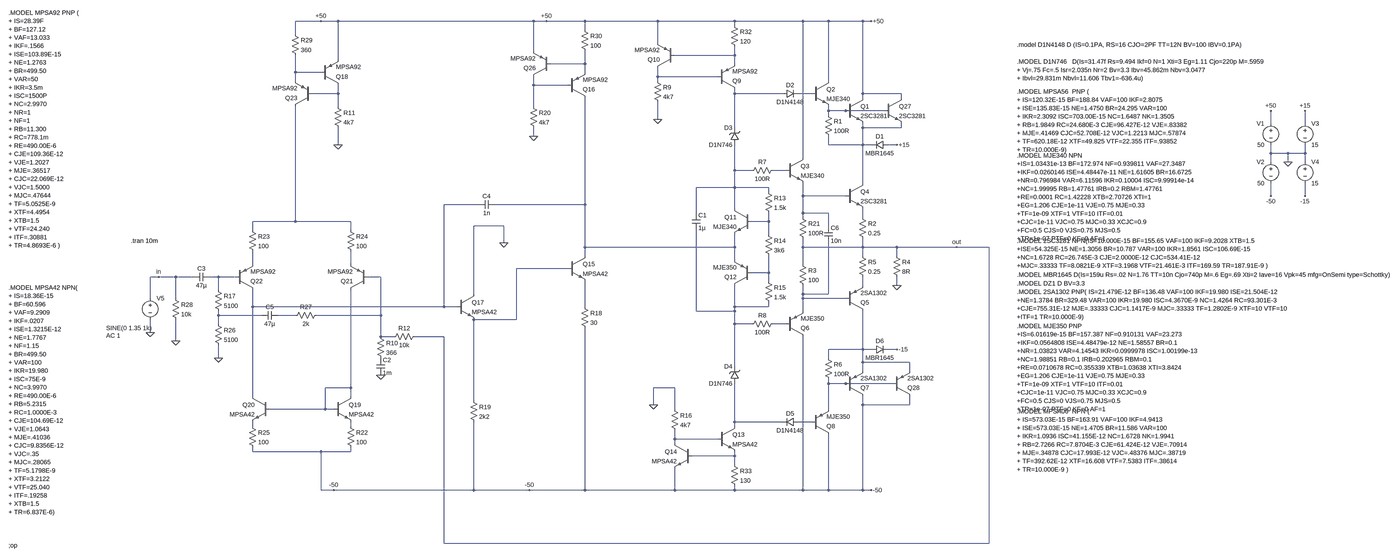
[diagram p0: schematic Clase G20062015_fft.asc, whole sheet]
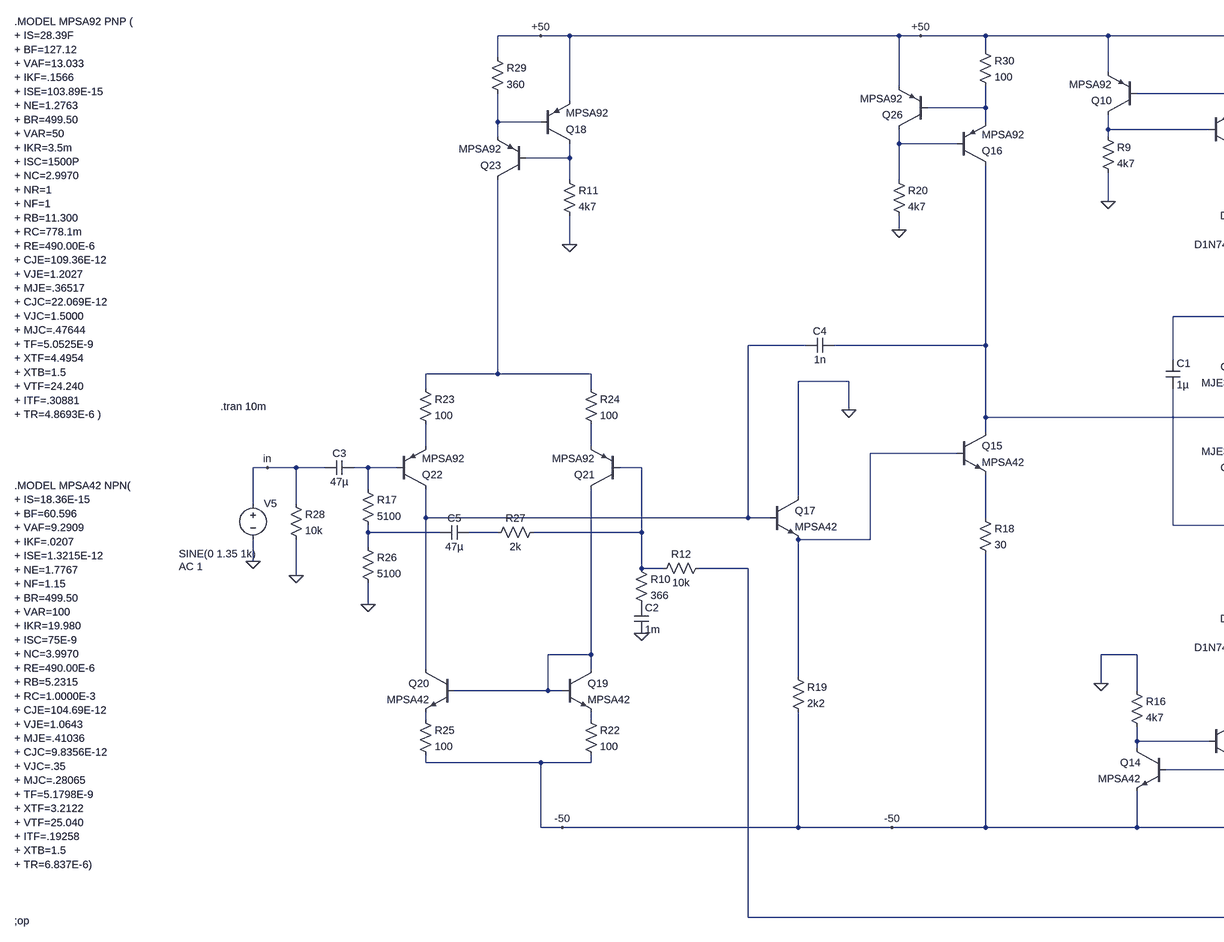
[diagram p1: schematic Clase G20062015_fft.asc, part, row 1 of 1, column 1 of 2]
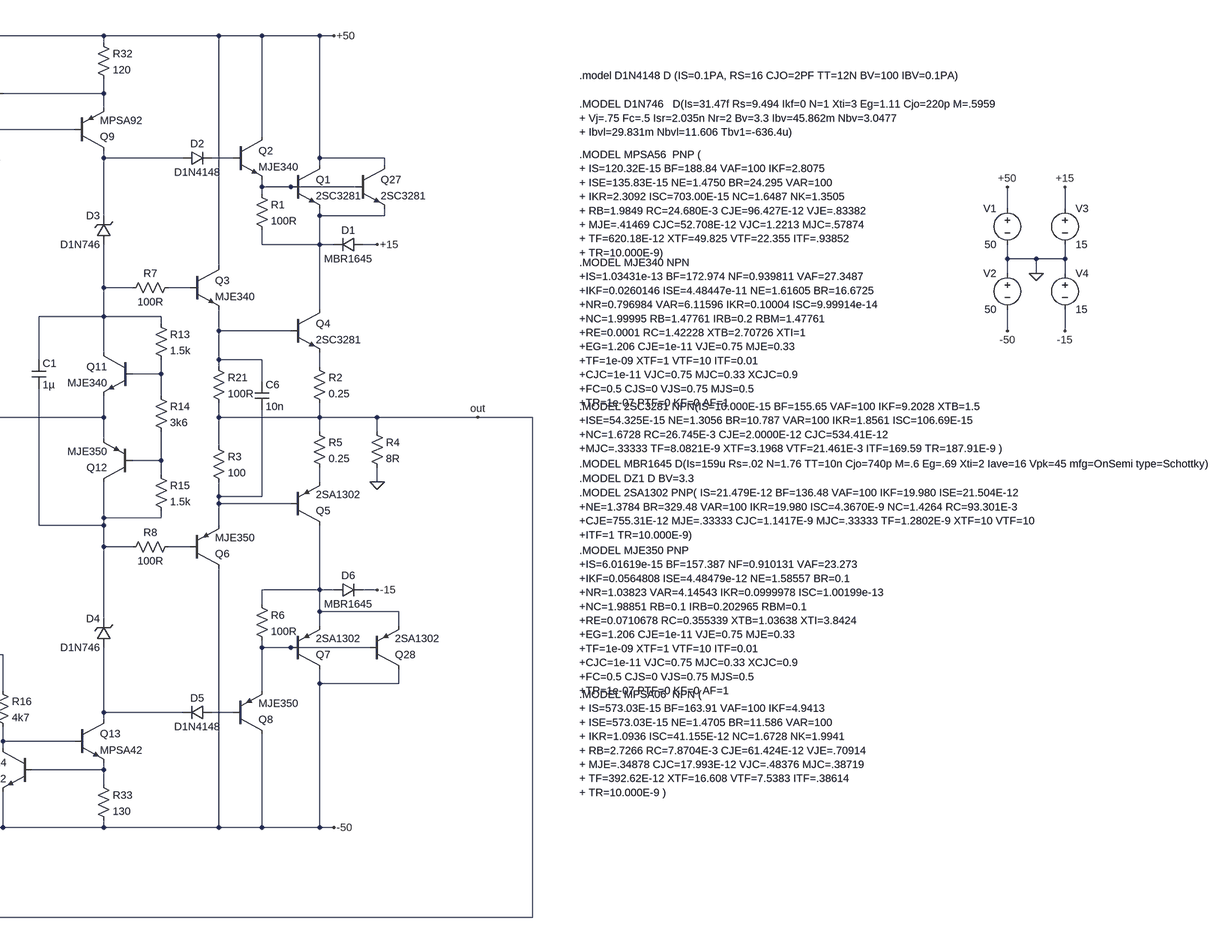
[diagram p2: schematic Clase G20062015_fft.asc, part, row 1 of 1, column 2 of 2]
Clase G20062015_fft.asc, the LTspice schematic file:
Version 4
SHEET 1 4608 680
WIRE 80 -1584 -16 -1584
WIRE 144 -1584 80 -1584
WIRE 992 -1584 144 -1584
WIRE 1040 -1584 992 -1584
WIRE 1184 -1584 1040 -1584
WIRE 1472 -1584 1184 -1584
WIRE 1760 -1584 1472 -1584
WIRE 2016 -1584 1760 -1584
WIRE 2112 -1584 2016 -1584
WIRE 2240 -1584 2112 -1584
WIRE 2272 -1584 2240 -1584
WIRE 1760 -1568 1760 -1584
WIRE 1184 -1552 1184 -1584
WIRE -16 -1536 -16 -1584
WIRE 1472 -1504 1472 -1584
WIRE 992 -1472 992 -1584
WIRE 1760 -1456 1760 -1488
WIRE 1760 -1456 1536 -1456
WIRE 144 -1440 144 -1584
WIRE 1184 -1424 1184 -1472
WIRE 1184 -1424 1056 -1424
WIRE 1760 -1424 1760 -1456
WIRE -16 -1392 -16 -1456
WIRE 80 -1392 -16 -1392
WIRE 1184 -1392 1184 -1424
WIRE 1472 -1376 1472 -1408
WIRE 1696 -1376 1472 -1376
WIRE -16 -1360 -16 -1392
WIRE 1472 -1360 1472 -1376
WIRE 2112 -1360 2112 -1584
WIRE 992 -1344 992 -1376
WIRE 1120 -1344 992 -1344
WIRE 144 -1312 144 -1344
WIRE 144 -1312 48 -1312
WIRE 1760 -1312 1760 -1328
WIRE 1936 -1312 1760 -1312
WIRE 2048 -1312 2000 -1312
WIRE 2240 -1312 2240 -1584
WIRE 2384 -1312 2240 -1312
WIRE 2240 -1296 2240 -1312
WIRE 2384 -1296 2384 -1312
WIRE 144 -1264 144 -1312
WIRE 992 -1264 992 -1344
WIRE 2112 -1248 2112 -1264
WIRE 2176 -1248 2112 -1248
WIRE 2320 -1248 2176 -1248
WIRE 2112 -1232 2112 -1248
WIRE 1472 -1216 1472 -1280
WIRE 3936 -1200 3936 -1248
WIRE 4064 -1200 4064 -1248
WIRE 1760 -1184 1760 -1312
WIRE 2240 -1184 2240 -1200
WIRE 2384 -1184 2384 -1200
WIRE 2384 -1184 2240 -1184
WIRE 992 -1152 992 -1184
WIRE 144 -1120 144 -1184
WIRE 2112 -1120 2112 -1152
WIRE 2240 -1120 2240 -1184
WIRE 2240 -1120 2112 -1120
WIRE 2272 -1120 2240 -1120
WIRE 2368 -1120 2336 -1120
WIRE 3936 -1088 3936 -1120
WIRE 4000 -1088 3936 -1088
WIRE 4064 -1088 4064 -1120
WIRE 4064 -1088 4000 -1088
WIRE 2016 -1072 2016 -1584
WIRE 3936 -1056 3936 -1088
WIRE 4000 -1056 4000 -1088
WIRE 4064 -1056 4064 -1088
WIRE 1760 -1024 1760 -1120
WIRE 1824 -1024 1760 -1024
WIRE 1952 -1024 1904 -1024
WIRE 2240 -976 2240 -1120
WIRE 1760 -960 1760 -1024
WIRE 1760 -960 1616 -960
WIRE 1888 -960 1760 -960
WIRE 1888 -944 1888 -960
WIRE 2016 -928 2016 -976
WIRE 2176 -928 2016 -928
WIRE 3936 -928 3936 -976
WIRE 4064 -928 4064 -976
WIRE 784 -896 656 -896
WIRE 1184 -896 1184 -1296
WIRE 1184 -896 848 -896
WIRE 1760 -880 1760 -960
WIRE 1616 -864 1616 -960
WIRE 2016 -864 2016 -928
WIRE 2112 -864 2016 -864
WIRE 2016 -848 2016 -864
WIRE 2240 -848 2240 -880
WIRE -16 -832 -16 -1264
WIRE -16 -832 -176 -832
WIRE 192 -832 -16 -832
WIRE 1888 -832 1888 -864
WIRE 1888 -832 1824 -832
WIRE 880 -816 768 -816
WIRE 2112 -816 2112 -864
WIRE -176 -800 -176 -832
WIRE 192 -800 192 -832
WIRE 1888 -784 1888 -832
WIRE 880 -752 880 -816
WIRE 1184 -736 1184 -896
WIRE 1760 -736 1760 -784
WIRE 1760 -736 1184 -736
WIRE 2016 -736 2016 -768
WIRE 2240 -736 2240 -768
WIRE 2240 -736 2016 -736
WIRE 2368 -736 2240 -736
WIRE 2592 -736 2368 -736
WIRE 2752 -736 2592 -736
WIRE 1184 -704 1184 -736
WIRE 2240 -704 2240 -736
WIRE 2368 -704 2368 -736
WIRE 1760 -688 1760 -736
WIRE -176 -672 -176 -720
WIRE 192 -672 192 -720
WIRE 2016 -672 2016 -736
WIRE 1120 -656 928 -656
WIRE 1888 -640 1888 -704
WIRE 1888 -640 1824 -640
WIRE -528 -624 -560 -624
WIRE -464 -624 -528 -624
WIRE -400 -624 -464 -624
WIRE -304 -624 -336 -624
WIRE -240 -624 -304 -624
WIRE 304 -624 256 -624
WIRE 1888 -608 1888 -640
WIRE 2240 -592 2240 -624
WIRE 2368 -592 2368 -624
WIRE -304 -576 -304 -624
WIRE 768 -560 768 -816
WIRE 2016 -560 2016 -592
WIRE 2112 -560 2112 -752
WIRE 2112 -560 2016 -560
WIRE -560 -544 -560 -624
WIRE -464 -544 -464 -624
WIRE 2016 -544 2016 -560
WIRE 2176 -544 2016 -544
WIRE -176 -512 -176 -576
WIRE 656 -512 656 -896
WIRE 656 -512 -176 -512
WIRE 704 -512 656 -512
WIRE 1184 -512 1184 -608
WIRE 1760 -512 1760 -592
WIRE 1888 -512 1888 -528
WIRE 1888 -512 1760 -512
WIRE 1616 -496 1616 -800
WIRE 1760 -496 1760 -512
WIRE 1760 -496 1616 -496
WIRE 2016 -496 2016 -544
WIRE -304 -480 -304 -496
WIRE -144 -480 -304 -480
WIRE -16 -480 -80 -480
WIRE 304 -480 304 -624
WIRE 304 -480 64 -480
WIRE 928 -464 928 -656
WIRE 928 -464 768 -464
WIRE -304 -448 -304 -480
WIRE 1760 -448 1760 -496
WIRE 1824 -448 1760 -448
WIRE 1952 -448 1904 -448
WIRE -560 -416 -560 -464
WIRE 304 -400 304 -480
WIRE 352 -400 304 -400
WIRE 656 -400 432 -400
WIRE -464 -384 -464 -464
WIRE 2240 -352 2240 -496
WIRE 2240 -352 2112 -352
WIRE 2272 -352 2240 -352
WIRE 2368 -352 2336 -352
WIRE 192 -336 192 -576
WIRE -304 -320 -304 -368
WIRE -176 -320 -176 -512
WIRE 2112 -320 2112 -352
WIRE 2240 -304 2240 -352
WIRE 2416 -304 2240 -304
WIRE 1760 -288 1760 -448
WIRE 2240 -272 2240 -304
WIRE 2416 -272 2416 -304
WIRE 2112 -224 2112 -240
WIRE 2176 -224 2112 -224
WIRE 2352 -224 2176 -224
WIRE 192 -208 192 -336
WIRE 192 -208 96 -208
WIRE 1536 -208 1456 -208
WIRE -176 -176 -176 -320
WIRE 192 -176 192 -208
WIRE 768 -160 768 -464
WIRE 1456 -144 1456 -208
WIRE 2240 -144 2240 -176
WIRE 2416 -144 2416 -176
WIRE 2416 -144 2240 -144
WIRE 96 -128 96 -208
WIRE 96 -128 -112 -128
WIRE 128 -128 96 -128
WIRE 1536 -128 1536 -208
WIRE 2112 -128 2112 -224
WIRE 1760 -80 1760 -224
WIRE 1936 -80 1760 -80
WIRE 2048 -80 2000 -80
WIRE -176 -64 -176 -80
WIRE 192 -64 192 -80
WIRE 1760 -64 1760 -80
WIRE 1536 -16 1536 -48
WIRE 1696 -16 1536 -16
WIRE 1536 0 1536 -16
WIRE -176 32 -176 16
WIRE 80 32 -176 32
WIRE 192 32 192 16
WIRE 192 32 80 32
WIRE 1760 48 1760 32
WIRE 1760 48 1600 48
WIRE 1760 80 1760 48
WIRE 80 176 80 32
WIRE 128 176 80 176
WIRE 768 176 768 -80
WIRE 768 176 128 176
WIRE 976 176 768 176
WIRE 1184 176 1184 -432
WIRE 1184 176 976 176
WIRE 1536 176 1536 96
WIRE 1536 176 1184 176
WIRE 1760 176 1760 160
WIRE 1760 176 1536 176
WIRE 2016 176 2016 -400
WIRE 2016 176 1760 176
WIRE 2112 176 2112 -32
WIRE 2112 176 2016 176
WIRE 2240 176 2240 -144
WIRE 2240 176 2112 176
WIRE 2272 176 2240 176
WIRE 656 384 656 -400
WIRE 2752 384 2752 -736
WIRE 2752 384 656 384
FLAG 2368 -592 0
FLAG 2272 176 -50
FLAG 2368 -352 -15
FLAG 2272 -1584 +50
FLAG 2368 -1120 +15
FLAG 1456 -144 0
FLAG 3936 -1248 +50
FLAG 3936 -928 -50
FLAG 4064 -1248 +15
FLAG 4064 -928 -15
FLAG 4000 -1056 0
FLAG 880 -752 0
FLAG -560 -416 0
FLAG 1472 -1216 0
FLAG 144 -1120 0
FLAG -304 -320 0
FLAG 304 -256 0
FLAG 992 -1152 0
FLAG 1040 -1584 +50
FLAG 976 176 -50
FLAG 128 176 -50
FLAG 80 -1584 +50
FLAG -464 -384 0
FLAG -528 -624 in
FLAG 2592 -736 out
DATAFLAG -176 -320 ""
DATAFLAG 192 -336 ""
SYMBOL npn 2176 -1296 R0
SYMATTR InstName Q1
SYMATTR Value 2SC3281
SYMBOL npn 2048 -1360 R0
SYMATTR InstName Q2
SYMATTR Value MJE340
SYMBOL res 2096 -1248 R0
SYMATTR InstName R1
SYMATTR Value 100R
SYMBOL diode 2336 -1136 R90
WINDOW 0 0 32 VBottom 2
WINDOW 3 32 32 VTop 2
SYMATTR InstName D1
SYMATTR Value MBR1645
SYMBOL diode 1936 -1296 R270
WINDOW 0 32 32 VTop 2
WINDOW 3 0 32 VBottom 2
SYMATTR InstName D2
SYMATTR Value D1N4148
SYMBOL zener 1776 -1120 R180
WINDOW 0 24 64 Left 2
WINDOW 3 24 0 Left 2
SYMATTR InstName D3
SYMATTR Value D1N746
SYMBOL npn 1952 -1072 R0
SYMATTR InstName Q3
SYMATTR Value MJE340
SYMBOL npn 2176 -976 R0
SYMATTR InstName Q4
SYMATTR Value 2SC3281
SYMBOL res 2224 -864 R0
SYMATTR InstName R2
SYMATTR Value 0.25
SYMBOL res 2000 -688 R0
SYMATTR InstName R3
SYMATTR Value 100
SYMBOL res 2352 -720 R0
SYMATTR InstName R4
SYMATTR Value 8R
SYMBOL res 2224 -720 R0
SYMATTR InstName R5
SYMATTR Value 0.25
SYMBOL pnp 2176 -496 M180
SYMATTR InstName Q5
SYMATTR Value 2SA1302
SYMBOL pnp 1952 -400 M180
SYMATTR InstName Q6
SYMATTR Value MJE350
SYMBOL pnp 2176 -176 M180
SYMATTR InstName Q7
SYMATTR Value 2SA1302
SYMBOL pnp 2048 -32 M180
SYMATTR InstName Q8
SYMATTR Value MJE350
SYMBOL res 2096 -336 R0
SYMATTR InstName R6
SYMATTR Value 100R
SYMBOL zener 1776 -224 R180
WINDOW 0 24 64 Left 2
WINDOW 3 24 0 Left 2
SYMATTR InstName D4
SYMATTR Value D1N746
SYMBOL diode 2000 -96 R90
WINDOW 0 0 32 VBottom 2
WINDOW 3 32 32 VTop 2
SYMATTR InstName D5
SYMATTR Value D1N4148
SYMBOL diode 2272 -336 R270
WINDOW 0 32 32 VTop 2
WINDOW 3 0 32 VBottom 2
SYMATTR InstName D6
SYMATTR Value MBR1645
SYMBOL res 1920 -1040 R90
WINDOW 0 0 56 VBottom 2
WINDOW 3 32 56 VTop 2
SYMATTR InstName R7
SYMATTR Value 100R
SYMBOL res 1920 -464 R90
WINDOW 0 0 56 VBottom 2
WINDOW 3 32 56 VTop 2
SYMATTR InstName R8
SYMATTR Value 100R
SYMBOL npn 1824 -880 M0
SYMATTR InstName Q11
SYMATTR Value MJE340
SYMBOL pnp 1824 -592 R180
SYMATTR InstName Q12
SYMATTR Value MJE350
SYMBOL res 1872 -960 R0
SYMATTR InstName R13
SYMATTR Value 1.5k
SYMBOL res 1872 -800 R0
SYMATTR InstName R14
SYMATTR Value 3k6
SYMBOL res 1872 -624 R0
SYMATTR InstName R15
SYMATTR Value 1.5k
SYMBOL npn 1696 -64 R0
SYMATTR InstName Q13
SYMATTR Value MPSA42
SYMBOL npn 1600 0 M0
SYMATTR InstName Q14
SYMATTR Value MPSA42
SYMBOL res 1520 -144 R0
SYMATTR InstName R16
SYMATTR Value 4k7
SYMBOL voltage 3936 -1216 M0
SYMATTR InstName V1
SYMATTR Value 50
SYMBOL voltage 3936 -1072 M0
SYMATTR InstName V2
SYMATTR Value 50
SYMBOL voltage 4064 -1216 R0
SYMATTR InstName V3
SYMATTR Value 15
SYMBOL voltage 4064 -1072 R0
SYMATTR InstName V4
SYMATTR Value 15
SYMBOL npn 1120 -704 R0
SYMATTR InstName Q15
SYMATTR Value MPSA42
SYMBOL res 1168 -528 R0
SYMATTR InstName R18
SYMATTR Value 30
SYMBOL npn 704 -560 R0
SYMATTR InstName Q17
SYMATTR Value MPSA42
SYMBOL res 752 -176 R0
SYMATTR InstName R19
SYMATTR Value 2k2
SYMBOL res 2000 -864 R0
SYMATTR InstName R21
SYMATTR Value 100R
SYMBOL npn 128 -176 R0
SYMATTR InstName Q19
SYMATTR Value MPSA42
SYMBOL npn -112 -176 M0
SYMATTR InstName Q20
SYMATTR Value MPSA42
SYMBOL pnp 256 -576 R180
SYMATTR InstName Q21
SYMATTR Value MPSA92
SYMBOL voltage -560 -560 R0
WINDOW 123 -165 156 Left 2
WINDOW 39 0 0 Left 2
WINDOW 3 -165 128 Left 2
SYMATTR Value2 AC 1
SYMATTR Value SINE(0 1.35 1k)
SYMATTR InstName V5
SYMBOL pnp -240 -576 M180
SYMATTR InstName Q22
SYMATTR Value MPSA92
SYMBOL res 176 -80 R0
SYMATTR InstName R22
SYMATTR Value 100
SYMBOL res -192 -816 R0
SYMATTR InstName R23
SYMATTR Value 100
SYMBOL res 176 -816 R0
SYMATTR InstName R24
SYMATTR Value 100
SYMBOL res -192 -80 R0
SYMATTR InstName R25
SYMATTR Value 100
SYMBOL pnp 1696 -1328 M180
SYMATTR InstName Q9
SYMATTR Value MPSA92
SYMBOL pnp 1536 -1408 R180
SYMATTR InstName Q10
SYMATTR Value MPSA92
SYMBOL res 1456 -1376 R0
SYMATTR InstName R9
SYMATTR Value 4k7
SYMBOL pnp 1120 -1296 M180
SYMATTR InstName Q16
SYMATTR Value MPSA92
SYMBOL pnp 80 -1344 M180
SYMATTR InstName Q18
SYMATTR Value MPSA92
SYMBOL res 128 -1280 R0
SYMATTR InstName R11
SYMATTR Value 4k7
SYMBOL pnp 48 -1264 R180
SYMATTR InstName Q23
SYMATTR Value MPSA92
SYMBOL res 288 -416 R0
SYMATTR InstName R10
SYMATTR Value 366
SYMBOL res 448 -416 R90
WINDOW 0 0 56 VBottom 2
WINDOW 3 32 56 VTop 2
SYMATTR InstName R12
SYMATTR Value 10k
SYMBOL res -320 -592 R0
SYMATTR InstName R17
SYMATTR Value 5100
SYMBOL cap 288 -320 R0
SYMATTR InstName C2
SYMATTR Value 1m
SYMBOL cap -336 -640 R90
WINDOW 0 0 32 VBottom 2
WINDOW 3 32 32 VTop 2
SYMATTR InstName C3
SYMATTR Value 47µ
SYMBOL cap 848 -912 R90
WINDOW 0 0 32 VBottom 2
WINDOW 3 32 32 VTop 2
SYMATTR InstName C4
SYMATTR Value 1n
SYMBOL pnp 1056 -1376 R180
SYMATTR InstName Q26
SYMATTR Value MPSA92
SYMBOL res 976 -1280 R0
SYMATTR InstName R20
SYMATTR Value 4k7
SYMBOL cap 1600 -864 R0
SYMATTR InstName C1
SYMATTR Value 1µ
SYMBOL res -320 -464 R0
SYMATTR InstName R26
SYMATTR Value 5100
SYMBOL cap -80 -496 R90
WINDOW 0 0 32 VBottom 2
WINDOW 3 32 32 VTop 2
SYMATTR InstName C5
SYMATTR Value 47µ
SYMBOL res 80 -496 R90
WINDOW 0 0 56 VBottom 2
WINDOW 3 32 56 VTop 2
SYMATTR InstName R27
SYMATTR Value 2k
SYMBOL res -480 -560 R0
SYMATTR InstName R28
SYMATTR Value 10k
SYMBOL cap 2096 -816 R0
SYMATTR InstName C6
SYMATTR Value 10n
SYMBOL npn 2320 -1296 R0
SYMATTR InstName Q27
SYMATTR Value 2SC3281
SYMBOL pnp 2352 -176 M180
SYMATTR InstName Q28
SYMATTR Value 2SA1302
SYMBOL res -32 -1552 R0
SYMATTR InstName R29
SYMATTR Value 360
SYMBOL res 1168 -1568 R0
SYMATTR InstName R30
SYMATTR Value 100
SYMBOL res 1744 -1584 R0
SYMATTR InstName R32
SYMATTR Value 120
SYMBOL res 1744 64 R0
SYMATTR InstName R33
SYMATTR Value 130
TEXT 2984 -600 Left 2 !.MODEL DZ1 D BV=3.3
TEXT 2984 -1320 Left 2 !.MODEL MPSA56  PNP (\n+ IS=120.32E-15 BF=188.84 VAF=100 IKF=2.8075\n+ ISE=135.83E-15 NE=1.4750 BR=24.295 VAR=100\n+ IKR=2.3092 ISC=703.00E-15 NC=1.6487 NK=1.3505\n+ RB=1.9849 RC=24.680E-3 CJE=96.427E-12 VJE=.83382\n+ MJE=.41469 CJC=52.708E-12 VJC=1.2213 MJC=.57874\n+ TF=620.18E-12 XTF=49.825 VTF=22.355 ITF=.93852\n+ TR=10.000E-9)
TEXT 2984 -1080 Left 2 !.MODEL MJE340 NPN\n+IS=1.03431e-13 BF=172.974 NF=0.939811 VAF=27.3487\n+IKF=0.0260146 ISE=4.48447e-11 NE=1.61605 BR=16.6725\n+NR=0.796984 VAR=6.11596 IKR=0.10004 ISC=9.99914e-14\n+NC=1.99995 RB=1.47761 IRB=0.2 RBM=1.47761\n+RE=0.0001 RC=1.42228 XTB=2.70726 XTI=1\n+EG=1.206 CJE=1e-11 VJE=0.75 MJE=0.33\n+TF=1e-09 XTF=1 VTF=10 ITF=0.01\n+CJC=1e-11 VJC=0.75 MJC=0.33 XCJC=0.9\n+FC=0.5 CJS=0 VJS=0.75 MJS=0.5\n+TR=1e-07 PTF=0 KF=0 AF=1
TEXT 2984 -760 Left 2 !.MODEL 2SC3281 NPN(IS=10.000E-15 BF=155.65 VAF=100 IKF=9.2028 XTB=1.5\n+ISE=54.325E-15 NE=1.3056 BR=10.787 VAR=100 IKR=1.8561 ISC=106.69E-15\n+NC=1.6728 RC=26.745E-3 CJE=2.0000E-12 CJC=534.41E-12\n+MJC=.33333 TF=8.0821E-9 XTF=3.1968 VTF=21.461E-3 ITF=169.59 TR=187.91E-9 )
TEXT 2984 -632 Left 2 !.MODEL MBR1645 D(Is=159u Rs=.02 N=1.76 TT=10n Cjo=740p M=.6 Eg=.69 Xti=2 Iave=16 Vpk=45 mfg=OnSemi type=Schottky)
TEXT 2984 -568 Left 2 !.MODEL 2SA1302 PNP( IS=21.479E-12 BF=136.48 VAF=100 IKF=19.980 ISE=21.504E-12\n+NE=1.3784 BR=329.48 VAR=100 IKR=19.980 ISC=4.3670E-9 NC=1.4264 RC=93.301E-3\n+CJE=755.31E-12 MJE=.33333 CJC=1.1417E-9 MJC=.33333 TF=1.2802E-9 XTF=10 VTF=10\n+ITF=1 TR=10.000E-9)
TEXT 2984 -440 Left 2 !.MODEL MJE350 PNP\n+IS=6.01619e-15 BF=157.387 NF=0.910131 VAF=23.273\n+IKF=0.0564808 ISE=4.48479e-12 NE=1.58557 BR=0.1\n+NR=1.03823 VAR=4.14543 IKR=0.0999978 ISC=1.00199e-13\n+NC=1.98851 RB=0.1 IRB=0.202965 RBM=0.1\n+RE=0.0710678 RC=0.355339 XTB=1.03638 XTI=3.8424\n+EG=1.206 CJE=1e-11 VJE=0.75 MJE=0.33\n+TF=1e-09 XTF=1 VTF=10 ITF=0.01\n+CJC=1e-11 VJC=0.75 MJC=0.33 XCJC=0.9\n+FC=0.5 CJS=0 VJS=0.75 MJS=0.5\n+TR=1e-07 PTF=0 KF=0 AF=1
TEXT 2984 -120 Left 2 !.MODEL MPSA06  NPN (\n+ IS=573.03E-15 BF=163.91 VAF=100 IKF=4.9413\n+ ISE=573.03E-15 NE=1.4705 BR=11.586 VAR=100\n+ IKR=1.0936 ISC=41.155E-12 NC=1.6728 NK=1.9941\n+ RB=2.7266 RC=7.8704E-3 CJE=61.424E-12 VJE=.70914\n+ MJE=.34878 CJC=17.993E-12 VJC=.48376 MJC=.38719\n+ TF=392.62E-12 XTF=16.608 VTF=7.5383 ITF=.38614\n+ TR=10.000E-9 )
TEXT 2984 -1432 Left 2 !.MODEL D1N746   D(Is=31.47f Rs=9.494 Ikf=0 N=1 Xti=3 Eg=1.11 Cjo=220p M=.5959\n+ Vj=.75 Fc=.5 Isr=2.035n Nr=2 Bv=3.3 Ibv=45.862m Nbv=3.0477\n+ Ibvl=29.831m Nbvl=11.606 Tbv1=-636.4u)
TEXT 2984 -1496 Left 2 !.model D1N4148 D (IS=0.1PA, RS=16 CJO=2PF TT=12N BV=100 IBV=0.1PA)
TEXT -1424 -1616 Left 2 !.MODEL MPSA92 PNP (\n+ IS=28.39F\n+ BF=127.12\n+ VAF=13.033\n+ IKF=.1566\n+ ISE=103.89E-15\n+ NE=1.2763\n+ BR=499.50\n+ VAR=50\n+ IKR=3.5m\n+ ISC=1500P\n+ NC=2.9970\n+ NR=1\n+ NF=1\n+ RB=11.300\n+ RC=778.1m\n+ RE=490.00E-6\n+ CJE=109.36E-12\n+ VJE=1.2027\n+ MJE=.36517\n+ CJC=22.069E-12\n+ VJC=1.5000\n+ MJC=.47644\n+ TF=5.0525E-9\n+ XTF=4.4954\n+ XTB=1.5\n+ VTF=24.240\n+ ITF=.30881\n+ TR=4.8693E-6 )
TEXT -1424 -584 Left 2 !.MODEL MPSA42 NPN(\n+ IS=18.36E-15\n+ BF=60.596\n+ VAF=9.2909\n+ IKF=.0207\n+ ISE=1.3215E-12\n+ NE=1.7767\n+ NF=1.15\n+ BR=499.50\n+ VAR=100\n+ IKR=19.980\n+ ISC=75E-9\n+ NC=3.9970\n+ RE=490.00E-6\n+ RB=5.2315\n+ RC=1.0000E-3\n+ CJE=104.69E-12\n+ VJE=1.0643\n+ MJE=.41036\n+ CJC=9.8356E-12\n+ VJC=.35\n+ MJC=.28065\n+ TF=5.1798E-9\n+ XTF=3.2122\n+ VTF=25.040\n+ ITF=.19258\n+ XTB=1.5\n+ TR=6.837E-6)
TEXT -1424 392 Left 2 !;op
TEXT -632 -760 Left 2 !.tran 10m

The netlist it stands for:
* Clase G20062015_fft.asc
Q1 +50 N009 N010 0 2SC3281
Q2 +50 N008 N009 0 MJE340
R1 N009 N010 100R
D1 +15 N010 MBR1645
D2 N007 N008 D1N4148
D3 N011 N007 D1N746
Q3 +50 N012 N013 0 MJE340
Q4 N010 N013 N016 0 2SC3281
R2 N016 out 0.25
R3 out N026 100
R4 out 0 8R
R5 out N025 0.25
Q5 N032 N026 N025 0 2SA1302
Q6 -50 N031 N026 0 MJE350
Q7 -50 N034 N032 0 2SA1302
Q8 -50 N036 N034 0 MJE350
R6 N032 N034 100R
D4 N035 N028 D1N746
D5 N036 N035 D1N4148
D6 N032 -15 MBR1645
R7 N012 N011 100R
R8 N031 N028 100R
Q11 N011 N018 N015 0 MJE340
Q12 N028 N022 N015 0 MJE350
R13 N011 N018 1.5k
R14 N018 N022 3k6
R15 N022 N028 1.5k
Q13 N035 N039 N040 0 MPSA42
Q14 N039 N040 -50 0 MPSA42
R16 0 N039 4k7
V1 +50 0 50
V2 0 -50 50
V3 +15 0 15
V4 0 -15 15
Q15 N015 N021 N027 0 MPSA42
R18 N027 -50 30
Q17 0 N014 N021 0 MPSA42
R19 N021 -50 2k2
R21 N013 out 100R
Q19 N033 N033 N038 0 MPSA42
Q20 N014 N033 N037 0 MPSA42
Q21 N033 N024 N020 0 MPSA92
V5 in 0 SINE(0 1.35 1k) AC 1
Q22 N014 N023 N019 0 MPSA92
R22 N038 -50 100
R23 N017 N019 100
R24 N017 N020 100
R25 N037 -50 100
Q9 N007 N004 N001 0 MPSA92
Q10 N004 N001 +50 0 MPSA92
R9 N004 0 4k7
Q16 N015 N005 N002 0 MPSA92
Q18 N006 N003 +50 0 MPSA92
R11 N006 0 4k7
Q23 N017 N006 N003 0 MPSA92
R10 N024 P001 366
R12 out N024 10k
R17 N023 N029 5100
C2 P001 0 1m
C3 N023 in 47µ
C4 N015 N014 1n
Q26 N005 N002 +50 0 MPSA92
R20 N005 0 4k7
C1 N011 N028 1µ
R26 N029 0 5100
C5 N030 N029 47µ
R27 N024 N030 2k
R28 in 0 10k
C6 N013 N026 10n
Q27 +50 N009 N010 0 2SC3281
Q28 -50 N034 N032 0 2SA1302
R29 +50 N003 360
R30 +50 N002 100
R32 +50 N001 120
R33 N040 -50 130
.model D D
.lib standard.dio
.model NPN NPN
.model PNP PNP
.lib standard.bjt
.MODEL DZ1 D BV=3.3
.MODEL MPSA56  PNP (
+ IS=120.32E-15 BF=188.84 VAF=100 IKF=2.8075
+ ISE=135.83E-15 NE=1.4750 BR=24.295 VAR=100
+ IKR=2.3092 ISC=703.00E-15 NC=1.6487 NK=1.3505
+ RB=1.9849 RC=24.680E-3 CJE=96.427E-12 VJE=.83382
+ MJE=.41469 CJC=52.708E-12 VJC=1.2213 MJC=.57874
+ TF=620.18E-12 XTF=49.825 VTF=22.355 ITF=.93852
+ TR=10.000E-9)
.MODEL MJE340 NPN
+IS=1.03431e-13 BF=172.974 NF=0.939811 VAF=27.3487
+IKF=0.0260146 ISE=4.48447e-11 NE=1.61605 BR=16.6725
+NR=0.796984 VAR=6.11596 IKR=0.10004 ISC=9.99914e-14
+NC=1.99995 RB=1.47761 IRB=0.2 RBM=1.47761
+RE=0.0001 RC=1.42228 XTB=2.70726 XTI=1
+EG=1.206 CJE=1e-11 VJE=0.75 MJE=0.33
+TF=1e-09 XTF=1 VTF=10 ITF=0.01
+CJC=1e-11 VJC=0.75 MJC=0.33 XCJC=0.9
+FC=0.5 CJS=0 VJS=0.75 MJS=0.5
+TR=1e-07 PTF=0 KF=0 AF=1
.MODEL 2SC3281 NPN(IS=10.000E-15 BF=155.65 VAF=100 IKF=9.2028 XTB=1.5
+ISE=54.325E-15 NE=1.3056 BR=10.787 VAR=100 IKR=1.8561 ISC=106.69E-15
+NC=1.6728 RC=26.745E-3 CJE=2.0000E-12 CJC=534.41E-12
+MJC=.33333 TF=8.0821E-9 XTF=3.1968 VTF=21.461E-3 ITF=169.59 TR=187.91E-9 )
.MODEL MBR1645 D(Is=159u Rs=.02 N=1.76 TT=10n Cjo=740p M=.6 Eg=.69 Xti=2 Iave=16 Vpk=45 mfg=OnSemi type=Schottky)
.MODEL 2SA1302 PNP( IS=21.479E-12 BF=136.48 VAF=100 IKF=19.980 ISE=21.504E-12
+NE=1.3784 BR=329.48 VAR=100 IKR=19.980 ISC=4.3670E-9 NC=1.4264 RC=93.301E-3
+CJE=755.31E-12 MJE=.33333 CJC=1.1417E-9 MJC=.33333 TF=1.2802E-9 XTF=10 VTF=10
+ITF=1 TR=10.000E-9)
.MODEL MJE350 PNP
+IS=6.01619e-15 BF=157.387 NF=0.910131 VAF=23.273
+IKF=0.0564808 ISE=4.48479e-12 NE=1.58557 BR=0.1
+NR=1.03823 VAR=4.14543 IKR=0.0999978 ISC=1.00199e-13
+NC=1.98851 RB=0.1 IRB=0.202965 RBM=0.1
+RE=0.0710678 RC=0.355339 XTB=1.03638 XTI=3.8424
+EG=1.206 CJE=1e-11 VJE=0.75 MJE=0.33
+TF=1e-09 XTF=1 VTF=10 ITF=0.01
+CJC=1e-11 VJC=0.75 MJC=0.33 XCJC=0.9
+FC=0.5 CJS=0 VJS=0.75 MJS=0.5
+TR=1e-07 PTF=0 KF=0 AF=1
.MODEL MPSA06  NPN (
+ IS=573.03E-15 BF=163.91 VAF=100 IKF=4.9413
+ ISE=573.03E-15 NE=1.4705 BR=11.586 VAR=100
+ IKR=1.0936 ISC=41.155E-12 NC=1.6728 NK=1.9941
+ RB=2.7266 RC=7.8704E-3 CJE=61.424E-12 VJE=.70914
+ MJE=.34878 CJC=17.993E-12 VJC=.48376 MJC=.38719
+ TF=392.62E-12 XTF=16.608 VTF=7.5383 ITF=.38614
+ TR=10.000E-9 )
.MODEL D1N746   D(Is=31.47f Rs=9.494 Ikf=0 N=1 Xti=3 Eg=1.11 Cjo=220p M=.5959
+ Vj=.75 Fc=.5 Isr=2.035n Nr=2 Bv=3.3 Ibv=45.862m Nbv=3.0477
+ Ibvl=29.831m Nbvl=11.606 Tbv1=-636.4u)
.model D1N4148 D (IS=0.1PA, RS=16 CJO=2PF TT=12N BV=100 IBV=0.1PA)
.MODEL MPSA92 PNP (
+ IS=28.39F
+ BF=127.12
+ VAF=13.033
+ IKF=.1566
+ ISE=103.89E-15
+ NE=1.2763
+ BR=499.50
+ VAR=50
+ IKR=3.5m
+ ISC=1500P
+ NC=2.9970
+ NR=1
+ NF=1
+ RB=11.300
+ RC=778.1m
+ RE=490.00E-6
+ CJE=109.36E-12
+ VJE=1.2027
+ MJE=.36517
+ CJC=22.069E-12
+ VJC=1.5000
+ MJC=.47644
+ TF=5.0525E-9
+ XTF=4.4954
+ XTB=1.5
+ VTF=24.240
+ ITF=.30881
+ TR=4.8693E-6 )
.MODEL MPSA42 NPN(
+ IS=18.36E-15
+ BF=60.596
+ VAF=9.2909
+ IKF=.0207
+ ISE=1.3215E-12
+ NE=1.7767
+ NF=1.15
+ BR=499.50
+ VAR=100
+ IKR=19.980
+ ISC=75E-9
+ NC=3.9970
+ RE=490.00E-6
+ RB=5.2315
+ RC=1.0000E-3
+ CJE=104.69E-12
+ VJE=1.0643
+ MJE=.41036
+ CJC=9.8356E-12
+ VJC=.35
+ MJC=.28065
+ TF=5.1798E-9
+ XTF=3.2122
+ VTF=25.040
+ ITF=.19258
+ XTB=1.5
+ TR=6.837E-6)
;op
.tran 10m
.backanno
.end